# EasyEDA schematic sch-knx-valve-control_v1.0.json
TITLE: KNX 8 Heating Actuators Control; REV: 1.0; Date: 2025-11-12; Sheet: 1/1; Company: LL Production
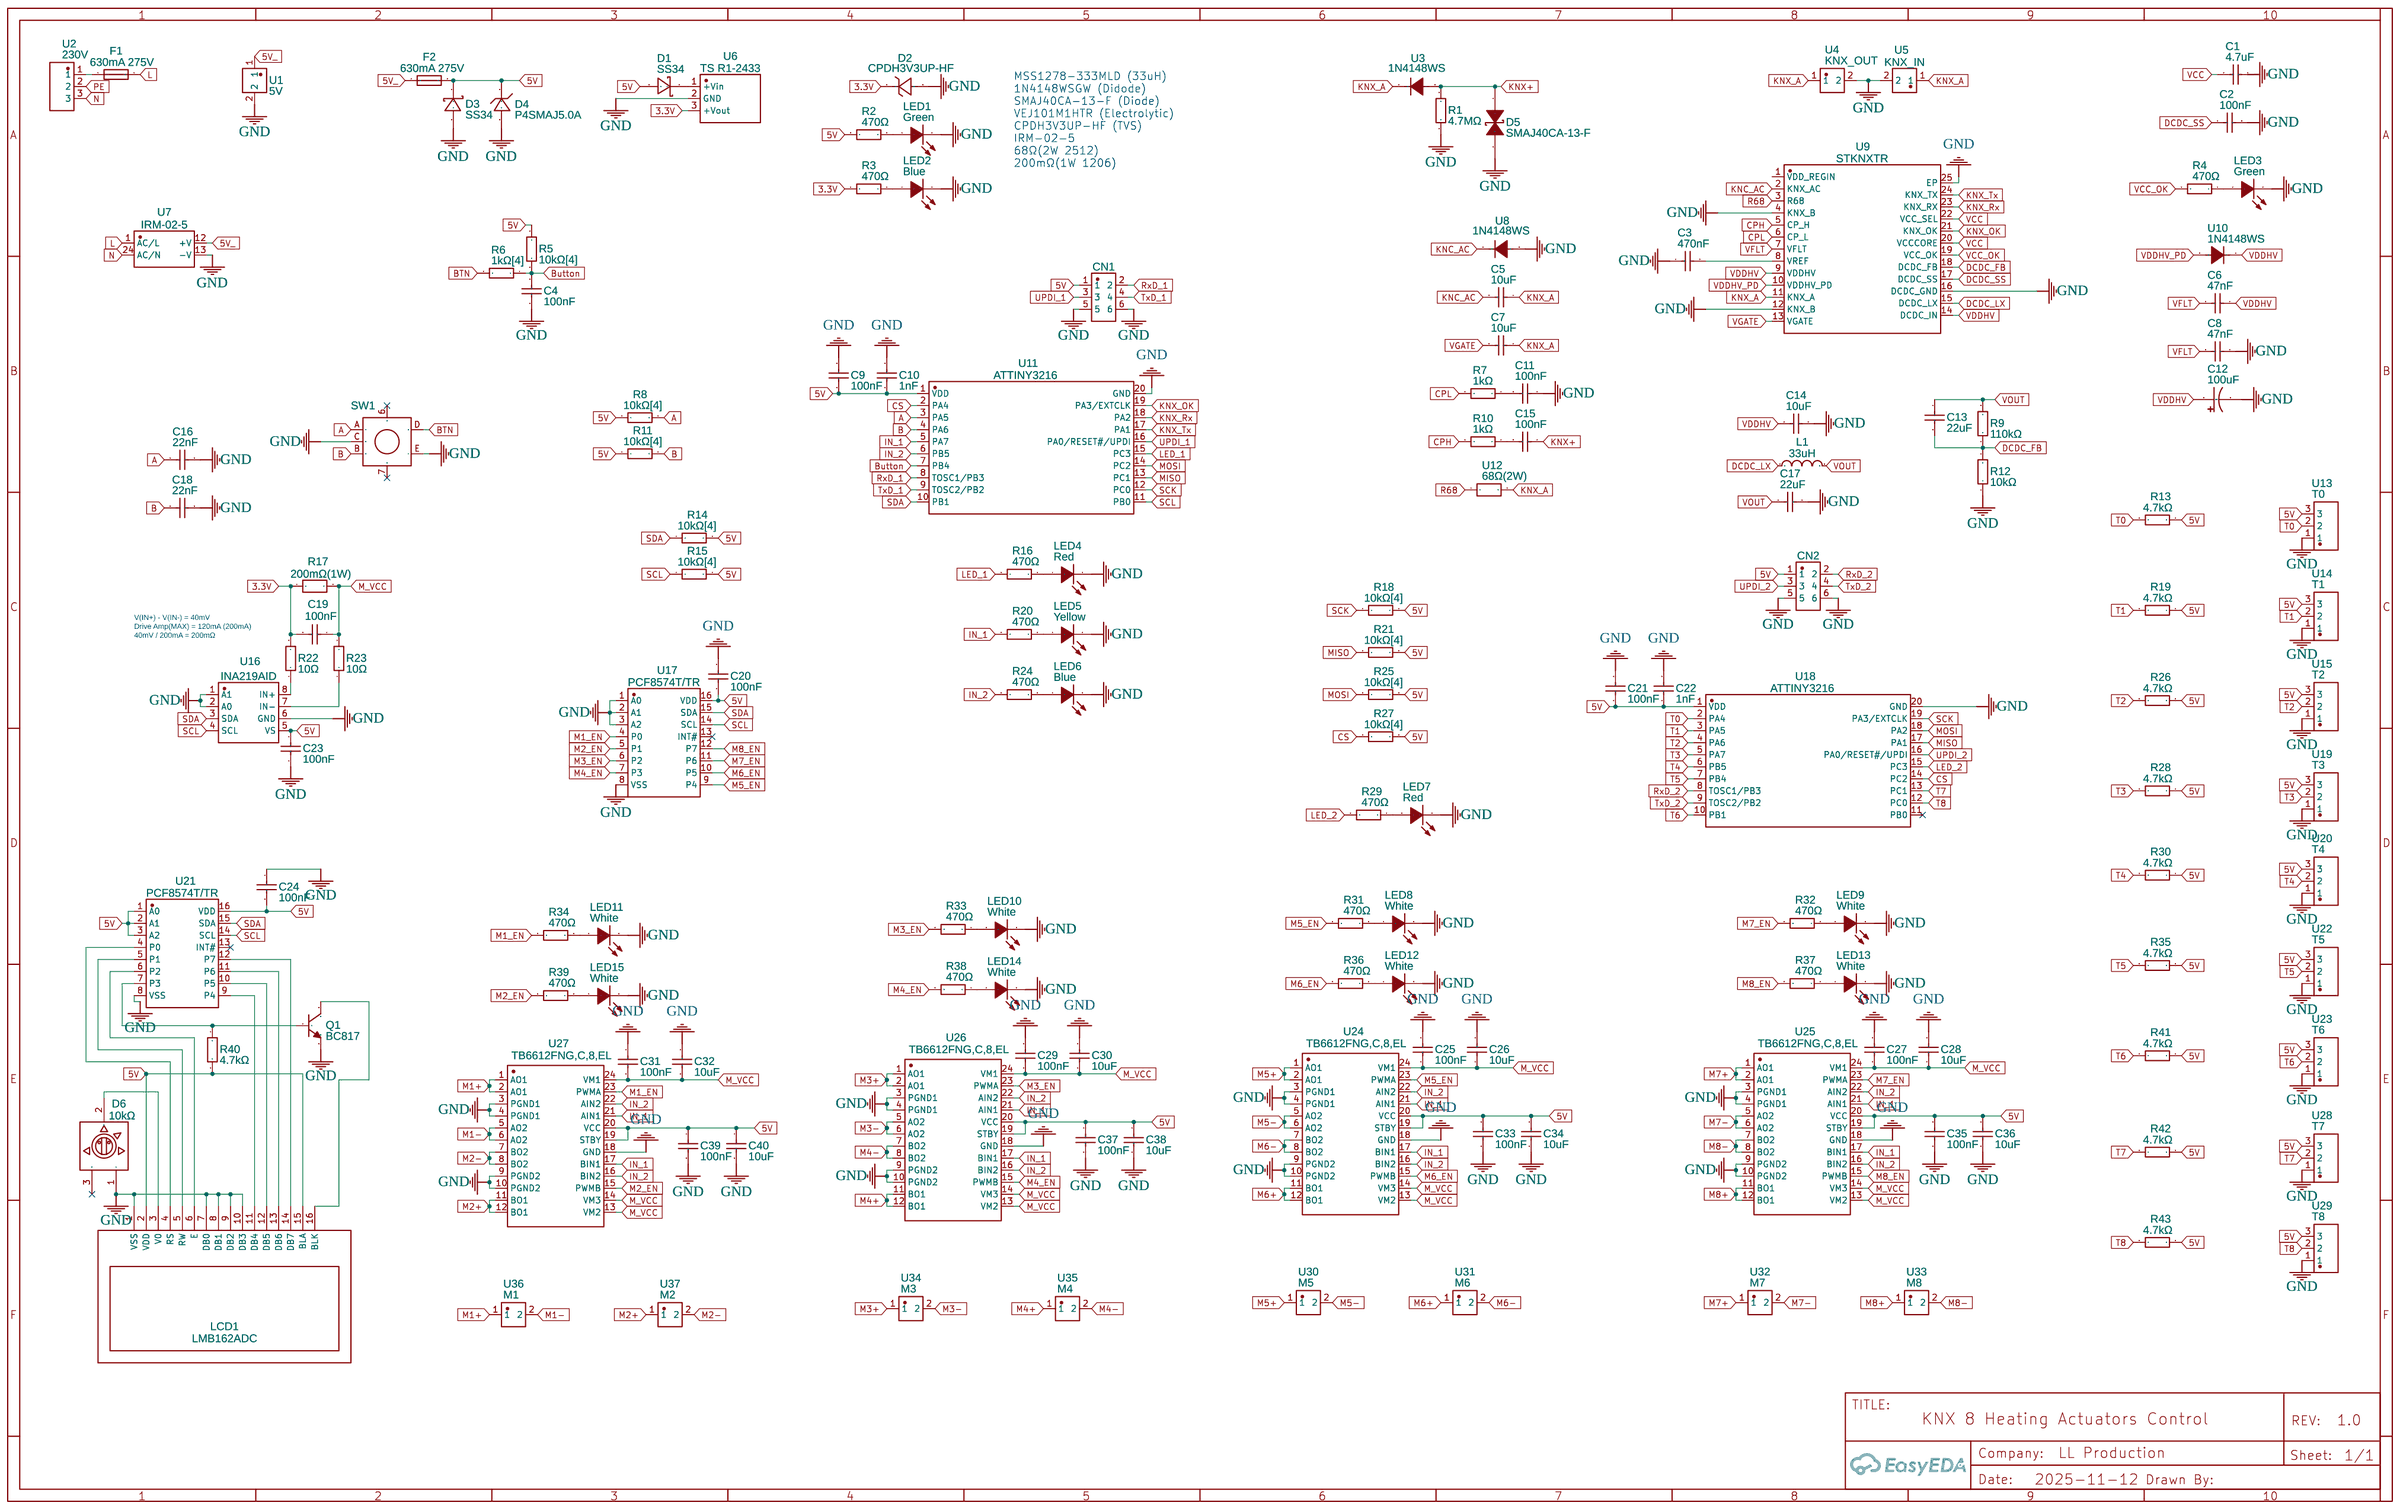
[diagram p0: schematic sheet]

## Parts
C1  4.7uF  [C0603]
C2  100nF  [C0603]
C3  470nF  [C0603]
C4  100nF  [C0603]
C5  10uF  [C0603]
C6  47nF  [C0603]
C7  10uF  [C0603]
C8  47nF  [C0603]
C9  100nF  [C0603]
C10  1nF  [C0603]
C11  100nF  [C0603]
C12  100uF  [CAP-SMD_BD8.0-L8.3-W8.3-RD]
C13  22uF  [C0603]
C14  10uF  [C0603]
C15  100nF  [C0603]
C16  22nF  [C0603]
C17  22uF  [C0603]
C18  22nF  [C0603]
C19  100nF  [C0603]
C20  100nF  [C0603]
C21  100nF  [C0603]
C22  1nF  [C0603]
C23  100nF  [C0603]
C24  100nF  [C0603]
C25  100nF  [C0603]
C26  10uF  [C0603]
C27  100nF  [C0603]
C28  10uF  [C0603]
C29  100nF  [C0603]
C30  10uF  [C0603]
C31  100nF  [C0603]
C32  10uF  [C0603]
C33  100nF  [C0603]
C34  10uF  [C0603]
C35  100nF  [C0603]
C36  10uF  [C0603]
C37  100nF  [C0603]
C38  10uF  [C0603]
C39  100nF  [C0603]
C40  10uF  [C0603]
CN1  321006SG0ABK00A01  [IDC-TH_321006SG0ABK00A01]
CN2  321006SG0ABK00A01  [IDC-TH_321006SG0ABK00A01]
D1  SS34  [SMA_L4.3-W2.6-LS5.2-RD]
D2  CPDH3V3UP-HF  [SOD-523_L1.2-W0.8-LS1.6-RD-1]
D3  SS34  [SMA_L4.3-W2.6-LS5.2-RD]
D4  P4SMAJ5.0A  [SMA_L4.3-W2.6-LS5.2-RD]
D5  SMAJ40CA-13-F  [SMA_L4.4-W2.6-LS5.0-BI]
D6  10kΩ  [RES-ADJ-SMD_3314G-1-103E]
F1  630mA 275V  [FUSE-SMD_L10.1-W3.1]
F2  630mA 275V  [FUSE-SMD_L10.1-W3.1]
L1  33uH  [IND-SMD_L12.0-W12.0_CHILISIN_MSS1278]
LCD1  LMB162ADC  [LCD1602]
LED1  Green  [LED0603-R-RD]
LED2  Blue  [LED0603-R-RD]
LED3  Green  [LED0603-R-RD]
LED4  Red  [LED0603-R-RD]
LED5  Yellow  [LED0603-R-RD]
LED6  Blue  [LED0603-R-RD]
LED7  Red  [LED0603-R-RD]
LED8  White  [LED0603-R-RD]
LED9  White  [LED0603-R-RD]
LED10  White  [LED0603-R-RD]
LED11  White  [LED0603-R-RD]
LED12  White  [LED0603-R-RD]
LED13  White  [LED0603-R-RD]
LED14  White  [LED0603-R-RD]
LED15  White  [LED0603-R-RD]
Q1  BC817  [SOT-23-3_L2.9-W1.6-P1.90-LS2.8-BR]
R1  4.7MΩ  [R0603]
R2  470Ω  [R0603]
R3  470Ω  [R0603]
R4  470Ω  [R0603]
R5  10kΩ[4]  [R0402]
R6  1kΩ[4]  [R0402]
R7  1kΩ  [R0603]
R8  10kΩ[4]  [R0402]
R9  110kΩ  [R0603]
R10  1kΩ  [R0603]
R11  10kΩ[4]  [R0402]
R12  10kΩ  [R0603]
R13  4.7kΩ  [R0603]
R14  10kΩ[4]  [R0402]
R15  10kΩ[4]  [R0402]
R16  470Ω  [R0603]
R17  200mΩ(1W)  [R1206]
R18  10kΩ[4]  [R0402]
R19  4.7kΩ  [R0603]
R20  470Ω  [R0603]
R21  10kΩ[4]  [R0402]
R22  10Ω  [R0603]
R23  10Ω  [R0603]
R24  470Ω  [R0603]
R25  10kΩ[4]  [R0402]
R26  4.7kΩ  [R0603]
R27  10kΩ[4]  [R0402]
R28  4.7kΩ  [R0603]
R29  470Ω  [R0603]
R30  4.7kΩ  [R0603]
R31  470Ω  [R0603]
R32  470Ω  [R0603]
R33  470Ω  [R0603]
R34  470Ω  [R0603]
R35  4.7kΩ  [R0603]
R36  470Ω  [R0603]
R37  470Ω  [R0603]
R38  470Ω  [R0603]
R39  470Ω  [R0603]
R40  4.7kΩ  [R0603]
R41  4.7kΩ  [R0603]
R42  4.7kΩ  [R0603]
R43  4.7kΩ  [R0603]
SW1  EC11L1525G01  [SW-TH_ALPS_EC11L1525G01]
U1  5V  [CONN-TH_2P-P5.08_C9900012979]
U2  230V  [CONN-TH_3P-P5.08_DB127V-5.08-3P-GN-S]
U3  1N4148WS  [SOD-323_L1.7-W1.3-LS2.7-RD]
U4  KNX_OUT  [CONN-TH_2P-P5.08_C9900012979]
U5  KNX_IN  [CONN-TH_2P-P5.08_C9900012979]
U6  TS R1-2433  [PWRM-TH_3P-L11.7-W7.6-P2.54_R1-2433]
U7  IRM-02-5  [PWRM-TH_L33.7-W22.2_IRM-02-24]
U8  1N4148WS  [SOD-323_L1.7-W1.3-LS2.7-RD]
U9  STKNXTR  [VFQFPN-24_L4.0-W4.0-P0.50-BL-EP2.8]
U10  1N4148WS  [SOD-323_L1.7-W1.3-LS2.7-RD]
U11  ATTINY3216  [SOIC-20_L13.0-W7.6-P1.27-LS10.3-BL]
U12  68Ω(2W)  [R2512]
U13  T0  [CONN-TH_3P-P5.08_DB127V-5.08-3P-GN-S]
U14  T1  [CONN-TH_3P-P5.08_DB127V-5.08-3P-GN-S]
U15  T2  [CONN-TH_3P-P5.08_DB127V-5.08-3P-GN-S]
U16  INA219AID  [SOIC-8_L4.9-W3.9-P1.27-LS6.0-BL]
U17  PCF8574T/TR  [SO-16_L10.3-W7.5-P1.27-LS10.3-BL]
U18  ATTINY3216  [SOIC-20_L13.0-W7.6-P1.27-LS10.3-BL]
U19  T3  [CONN-TH_3P-P5.08_DB127V-5.08-3P-GN-S]
U20  T4  [CONN-TH_3P-P5.08_DB127V-5.08-3P-GN-S]
U21  PCF8574T/TR  [SO-16_L10.3-W7.5-P1.27-LS10.3-BL]
U22  T5  [CONN-TH_3P-P5.08_DB127V-5.08-3P-GN-S]
U23  T6  [CONN-TH_3P-P5.08_DB127V-5.08-3P-GN-S]
U24  TB6612FNG,C,8,EL  [SSOP-24_L8.3-W5.6-P0.65-LS7.6-BL]
U25  TB6612FNG,C,8,EL  [SSOP-24_L8.3-W5.6-P0.65-LS7.6-BL]
U26  TB6612FNG,C,8,EL  [SSOP-24_L8.3-W5.6-P0.65-LS7.6-BL]
U27  TB6612FNG,C,8,EL  [SSOP-24_L8.3-W5.6-P0.65-LS7.6-BL]
U28  T7  [CONN-TH_3P-P5.08_DB127V-5.08-3P-GN-S]
U29  T8  [CONN-TH_3P-P5.08_DB127V-5.08-3P-GN-S]
U30  M5  [CONN-TH_2P-P5.08_C9900012979]
U31  M6  [CONN-TH_2P-P5.08_C9900012979]
U32  M7  [CONN-TH_2P-P5.08_C9900012979]
U33  M8  [CONN-TH_2P-P5.08_C9900012979]
U34  M3  [CONN-TH_2P-P5.08_C9900012979]
U35  M4  [CONN-TH_2P-P5.08_C9900012979]
U36  M1  [CONN-TH_2P-P5.08_C9900012979]
U37  M2  [CONN-TH_2P-P5.08_C9900012979]

## Library data of the parts
C1-C11 C13-C40 = CC0603KRX7R9BB103: Supplier: LCSC; Manufacturer: YAGEO; Supplier Part: C100042; JLCPCB Part Class: Extended Part
C12 = VEJ101M1HTR-0810: Contributor: LCSC; Supplier: LCSC; Supplier Part: C176665; Manufacturer: Lelon(立隆); JLCPCB Part Class: Extended Part
CN1 CN2 = 321006SG0ABK00A01: Contributor: LCSC; Supplier: LCSC; Supplier Part: C601936; Manufacturer: JILN(锦凌); JLCPCB Part Class: Extended Part; link: https://lcsc.com/eda_search?q=C601936&%26type=1&ref=editor
D1 D3 = SS34_C8678: Supplier: LCSC; Manufacturer: MDD; Supplier Part: C8678; JLCPCB Part Class: Basic Part; link: https://lcsc.com/eda_search?q=C8678&%26type=1&ref=editor
D2 = SOD-523: Contributor: LCSC; Supplier: LCSC; Supplier Part: C9900005315; Manufacturer: null; JLCPCB Part Class: Extended Part
D4 = P4SMAJ12A-PEC: Contributor: LCSC; Supplier: LCSC; Supplier Part: C263332; Manufacturer: PANJIT(强茂); Manufacturer Part: P4SMAJ12A_R1_00001; JLCPCB Part Class: Extended Part
D5 = SMAJ40CA-13-F: Contributor: LCSC; Supplier: LCSC; Manufacturer: DIODES(美台); Supplier Part: C134986; JLCPCB Part Class: Extended Part
D6 = 3314G-1-103E: Contributor: LCSC; Supplier: LCSC; Supplier Part: C780220; Manufacturer: BOURNS; JLCPCB Part Class: Extended Part; link: https://lcsc.com/eda_search?q=C780220&%26type=1&ref=editor
F1 F2 = S1032-F-60.0A: Contributor: LCSC; Supplier: LCSC; Supplier Part: C553920; Manufacturer: SART(萨特); JLCPCB Part Class: Extended Part
L1 = MSS1278-333MLD: Contributor: lcsc; Supplier: LCSC; Supplier Part: C9900015074; Manufacturer: null; JLCPCB Part Class: Extended Part
LCD1 = LMB162ADC: Supplier: LCSC; Manufacturer: TOPWAY; Supplier Part: C9741
LED1-LED15 = SZYY0603R: Supplier: LCSC; Supplier Part: C434419; Manufacturer: yongyu(永裕光电); Contributor: LCSC; JLCPCB Part Class: Extended Part
Q1 = BC817-40,215: Supplier: LCSC; Manufacturer: Nexperia(安世); Supplier Part: C52801; JLCPCB Part Class: Extended Part
R1-R4 R7 R9 R10 R12 R13 R16 R19 R20 R22-R24 R26 R28-R43 = CR0603FA1001G_C126900: Supplier: LCSC; Manufacturer: LIZ(丽智电子); Manufacturer Part: CR0603FA1001G; Supplier Part: C126900; Resistance (Ohms): 1K; JLCPCB Part Class: Extended Part
R5 R6 R8 R11 R14 R15 R18 R21 R25 R27 = 0402WGF1002TCE: Supplier: LCSC; Manufacturer: UNI-ROYAL(厚声); Supplier Part: C25744; JLCPCB Part Class: Basic Part
R17 = SCR1206F1M1: Supplier: LCSC; Supplier Part: C3017245; Manufacturer: VO(翔胜); JLCPCB Part Class: Extended Part; Contributor: lcsc
SW1 = EC11L1525G01: Contributor: lcsc; Supplier: LCSC; Supplier Part: C2991196; Manufacturer: ALPSALPINE(阿尔卑斯阿尔派); JLCPCB Part Class: Extended Part; link: https://lcsc.com/eda_search?q=C2991196&%26type=1&ref=editor
U1 U4 U5 U30-U37 = 2P,间距5.08MM,弹片压线升降式: Supplier: LCSC; Supplier Part: C9900012979; Manufacturer: null; Manufacturer Part: 2P,间距5.08mm,弹片压线升降式; Contributor: LCSC; JLCPCB Part Class: Extended Part
U2 U13-U15 U19 U20 U22 U23 U28 U29 = DB127V-5.08-3P-GN-S: Supplier: LCSC; Supplier Part: C3018699; Manufacturer: DIBO(地博电气); link: https://atta.szlcsc.com/upload/public/pdf/source/20230106/9E8F75CF958F44CA83513B3CECA15E79.pdf; Contributor: lcsc; JLCPCB Part Class: Extended Part
U3 U8 U10 = 1N4148WS: Supplier: LCSC; Supplier Part: C19272188; Manufacturer: Zhengxin(正芯); Contributor: lcsc
U6 = TS R1-2433: Supplier: LCSC; Supplier Part: C5455553; Manufacturer: TRACO POWER; JLCPCB Part Class: Extended Part; Contributor: lcsc
U7 = IRM-02-5: Supplier: LCSC; Supplier Part: C22394236; Manufacturer: MW(明纬); Contributor: lcsc; JLCPCB Part Class: Extended Part
U9 = STKNXTR: Contributor: LCSC; Supplier: LCSC; Supplier Part: C2671486; Manufacturer: ST(意法半导体); JLCPCB Part Class: Extended Part
U11 U18 = ATTINY1616-SN_C614136: Contributor: lcsc; Supplier: LCSC; Supplier Part: C614136; Manufacturer: MICROCHIP(美国微芯); Manufacturer Part: ATTINY1616-SN; link: https://lcsc.com/eda_search?q=C614136&%26type=1&ref=editor
U12 = HOJLR2512-3W-3.5MR-1%: Contributor: lcsc; Supplier: LCSC; Supplier Part: C2904235; Manufacturer: Milliohm(毫欧); Manufacturer Part: HoJLR2512-3W-3.5mR-1%; JLCPCB Part Class: Extended Part
U16 = INA219AID: Contributor: lcsc; Supplier: LCSC; Supplier Part: C1574856; Manufacturer: TI(德州仪器); JLCPCB Part Class: Extended Part
U17 U21 = PCF8574T/TR: Supplier: LCSC; Supplier Part: C2987288; Manufacturer: HGSEMI(华冠); link: https://atta.szlcsc.com/upload/public/pdf/source/20190611/C398075_1925312D8618E19C6137781D5B71A3CA.pdf; Contributor: lcsc; JLCPCB Part Class: Extended Part
U24-U27 = TB6612FNG,C,8,EL: Contributor: LCSC; Supplier: LCSC; Manufacturer: TOSHIBA(东芝); Supplier Part: C141517; JLCPCB Part Class: Extended Part

## Nets
3.3V: C19.2 D2.1(K) R3.2 R17.1 R22.2 U6.3(+Vout)
5V: C9.1 C10.1 C20.2 C21.1 C22.1 C23.1 C24.2 C33.1 C34.1 C35.1 C36.1 C37.1 C38.1 C39.1 C40.1 CN1.1 CN2.1 D1.2(A) D3.1(K) D4.1(C) F2.2 LCD1.2(VDD) LCD1.15(BLA) R2.2 R5.1 R8.1 R11.1 R13.1 R14.2 R15.2 R18.2 R19.1 R21.2 R25.2 R26.1 R27.2 R28.1 R30.1 R35.1 R40.2 R41.1 R42.1 R43.1 U11.1(VDD) U13.3 U14.3 U15.3 U16.5(VS) U17.16(VDD) U18.1(VDD) U19.3 U20.3 U21.1(A0) U21.2(A1) U21.3(A2) U21.16(VDD) U22.3 U23.3 U24.19(STBY) U24.20(VCC) U25.19(STBY) U25.20(VCC) U26.19(STBY) U26.20(VCC) U27.19(STBY) U27.20(VCC) U28.3 U29.3
5V_: F2.1 U1.1 U7.12(+V)
GND: C1.1 C2.2 C3.1 C4.2 C8.1 C9.2 C10.2 C11.1 C12.2 C14.2 C16.1 C17.2 C18.1 C20.1 C21.2 C22.2 C23.2 C24.1 C25.1 C26.1 C27.1 C28.1 C29.1 C30.1 C31.1 C32.1 C33.2 C34.2 C35.2 C36.2 C37.2 C38.2 C39.2 C40.2 CN1.5 CN1.6 CN2.5 CN2.6 D2.2(A) D3.2(A) D4.2(A) D5.2 D6.1 LCD1.1(VSS) LCD1.7(DB0) LCD1.8(DB1) LCD1.9(DB2) LCD1.10(DB3) LED1.2(-) LED2.2(-) LED3.2(-) LED4.2(-) LED5.2(-) LED6.2(-) LED7.2(-) LED8.2(-) LED9.2(-) LED10.2(-) LED11.2(-) LED12.2(-) LED13.2(-) LED14.2(-) LED15.2(-) Q1.2 R1.1 R12.1 SW1.C SW1.E U1.2 U4.2 U5.2 U6.2(GND) U7.13(-V) U8.2(A) U9.4(KNX_B) U9.12(KNX_B) U9.16(DCDC_GND) U9.25(EP) U11.20(GND) U13.1 U14.1 U15.1 U16.1(A1) U16.2(A0) U16.6(GND) U17.1(A0) U17.2(A1) U17.3(A2) U17.8(VSS) U18.20(GND) U19.1 U20.1 U21.8(VSS) U22.1 U23.1 U24.3(PGND1) U24.4(PGND1) U24.9(PGND2) U24.10(PGND2) U24.18(GND) U25.3(PGND1) U25.4(PGND1) U25.9(PGND2) U25.10(PGND2) U25.18(GND) U26.3(PGND1) U26.4(PGND1) U26.9(PGND2) U26.10(PGND2) U26.18(GND) U27.3(PGND1) U27.4(PGND1) U27.9(PGND2) U27.10(PGND2) U27.18(GND) U28.1 U29.1
VCC: C1.2 U9.20(VCCCORE) U9.22(VCC_SEL)
VCC_OK: R4.2 U9.19(VCC_OK)
VDDHV: C6.1 C12.1 C14.1 U9.9(VDDHV) U9.14(DCDC_IN) U10.1(K)
VDDHV_PD: U9.10(VDDHV_PD) U10.2(A)
A: C16.2 R8.2 SW1.A U11.3(PA5)
B: C18.2 R11.2 SW1.B U11.4(PA6)
BTN: R6.2 SW1.D
Button: C4.1 R5.2 R6.1 U11.7(PB4)
CPH: R10.2 U9.5(CP_H)
CPL: R7.2 U9.6(CP_L)
CS: R27.1 U11.2(PA4) U18.14(PC2)
DCDC_FB: C13.2 R9.1 R12.2 U9.18(DCDC_FB)
DCDC_LX: L1.1 U9.15(DCDC_LX)
DCDC_SS: C2.1 U9.17(DCDC_SS)
IN_1: R20.2 U11.5(PA7) U24.17(BIN1) U24.21(AIN1) U25.17(BIN1) U25.21(AIN1) U26.17(BIN1) U26.21(AIN1) U27.17(BIN1) U27.21(AIN1)
IN_2: R24.2 U11.6(PB5) U24.16(BIN2) U24.22(AIN2) U25.16(BIN2) U25.22(AIN2) U26.16(BIN2) U26.22(AIN2) U27.16(BIN2) U27.22(AIN2)
KNC_AC: C5.2 U8.1(K) U9.2(KNX_AC)
KNX+: C15.1 D5.1 R1.2 U3.2(A)
KNX_A: C5.1 C7.1 U3.1(K) U4.1 U5.1 U9.11(KNX_A) U12.2
KNX_OK: U9.21(KNX_OK) U11.19(PA3/EXTCLK)
KNX_Rx: U9.23(KNX_RX) U11.18(PA2)
KNX_Tx: U9.24(KNX_TX) U11.17(PA1)
L: F1.2 U7.1(AC/L)
LED_1: R16.2 U11.15(PC3)
LED_2: R29.2 U18.15(PC3)
M1+: U27.1(AO1) U27.2(AO1) U36.1
M1-: U27.5(AO2) U27.6(AO2) U36.2
M1_EN: R34.2 U17.4(P0) U27.23(PWMA)
M2+: U27.11(BO1) U27.12(BO1) U37.1
M2-: U27.7(BO2) U27.8(BO2) U37.2
M2_EN: R39.2 U17.5(P1) U27.15(PWMB)
M3+: U26.1(AO1) U26.2(AO1) U34.1
M3-: U26.5(AO2) U26.6(AO2) U34.2
M3_EN: R33.2 U17.6(P2) U26.23(PWMA)
M4+: U26.11(BO1) U26.12(BO1) U35.1
M4-: U26.7(BO2) U26.8(BO2) U35.2
M4_EN: R38.2 U17.7(P3) U26.15(PWMB)
M5+: U24.1(AO1) U24.2(AO1) U30.1
M5-: U24.5(AO2) U24.6(AO2) U30.2
M5_EN: R31.2 U17.9(P4) U24.23(PWMA)
M6+: U24.11(BO1) U24.12(BO1) U31.1
M6-: U24.7(BO2) U24.8(BO2) U31.2
M6_EN: R36.2 U17.10(P5) U24.15(PWMB)
M7+: U25.1(AO1) U25.2(AO1) U32.1
M7-: U25.5(AO2) U25.6(AO2) U32.2
M7_EN: R32.2 U17.11(P6) U25.23(PWMA)
M8+: U25.11(BO1) U25.12(BO1) U33.1
M8-: U25.7(BO2) U25.8(BO2) U33.2
M8_EN: R37.2 U17.12(P7) U25.15(PWMB)
M_VCC: C19.1 C25.2 C26.2 C27.2 C28.2 C29.2 C30.2 C31.2 C32.2 R17.2 R23.2 U24.13(VM2) U24.14(VM3) U24.24(VM1) U25.13(VM2) U25.14(VM3) U25.24(VM1) U26.13(VM2) U26.14(VM3) U26.24(VM1) U27.13(VM2) U27.14(VM3) U27.24(VM1)
MISO: R21.1 U11.13(PC1) U18.17(PA1)
MOSI: R25.1 U11.14(PC2) U18.18(PA2)
N: U2.3 U7.24(AC/N)
PE: U2.2
R68: U9.3(R68) U12.1
RxD_1: CN1.2 U11.8(TOSC1/PB3)
RxD_2: CN2.2 U18.8(TOSC1/PB3)
SCK: R18.1 U11.12(PC0) U18.19(PA3/EXTCLK)
SCL: R15.1 U11.11(PB0) U16.4(SCL) U17.14(SCL) U21.14(SCL)
SDA: R14.1 U11.10(PB1) U16.3(SDA) U17.15(SDA) U21.15(SDA)
T0: R13.2 U13.2 U18.2(PA4)
T1: R19.2 U14.2 U18.3(PA5)
T2: R26.2 U15.2 U18.4(PA6)
T3: R28.2 U18.5(PA7) U19.2
T4: R30.2 U18.6(PB5) U20.2
T5: R35.2 U18.7(PB4) U22.2
T6: R41.2 U18.10(PB1) U23.2
T7: R42.2 U18.13(PC1) U28.2
T8: R43.2 U18.12(PC0) U29.2
TxD_1: CN1.4 U11.9(TOSC2/PB2)
TxD_2: CN2.4 U18.9(TOSC2/PB2)
UPDI_1: CN1.3 U11.16(PA0/RESET#/UPDI)
UPDI_2: CN2.3 U18.16(PA0/RESET#/UPDI)
VFLT: C6.2 C8.2 U9.7(VFLT)
VGATE: C7.2 U9.13(VGATE)
VOUT: C13.1 C17.1 L1.2 R9.2
Net-(C3-2): C3.2 U9.8(VREF)
Net-(C11-2): C11.2 R7.1
Net-(C15-2): C15.2 R10.1
Net-(D1-1): D1.1(K) U6.1(+Vin)
Net-(D6-2): D6.2 LCD1.3(V0)
Net-(F1-1): F1.1 U2.1
Net-(LCD1-4): LCD1.4(RS) U21.4(P0)
Net-(LCD1-5): LCD1.5(RW) U21.5(P1)
Net-(LCD1-6): LCD1.6(E) U21.6(P2)
Net-(LCD1-11): LCD1.11(DB4) U21.9(P4)
Net-(LCD1-12): LCD1.12(DB5) U21.10(P5)
Net-(LCD1-13): LCD1.13(DB6) U21.11(P6)
Net-(LCD1-14): LCD1.14(DB7) U21.12(P7)
Net-(LCD1-16): LCD1.16(BLK) Q1.3
Net-(LED1-1): LED1.1(+) R2.1
Net-(LED2-1): LED2.1(+) R3.1
Net-(LED3-1): LED3.1(+) R4.1
Net-(LED4-1): LED4.1(+) R16.1
Net-(LED5-1): LED5.1(+) R20.1
Net-(LED6-1): LED6.1(+) R24.1
Net-(LED7-1): LED7.1(+) R29.1
Net-(LED8-1): LED8.1(+) R31.1
Net-(LED9-1): LED9.1(+) R32.1
Net-(LED10-1): LED10.1(+) R33.1
Net-(LED11-1): LED11.1(+) R34.1
Net-(LED12-1): LED12.1(+) R36.1
Net-(LED13-1): LED13.1(+) R37.1
Net-(LED14-1): LED14.1(+) R38.1
Net-(LED15-1): LED15.1(+) R39.1
Net-(Q1-1): Q1.1 R40.1 U21.7(P3)
Net-(R22-1): R22.1 U16.8(IN+)
Net-(R23-1): R23.1 U16.7(IN-)

Not connected (* = marked no-connect by the designer): D6 3*; SW1 6(EH)* 7(EH)*; U9 1(VDD_REGIN); U17 13(INT#)*; U18 11(PB0)*; U21 13(INT#)*

## Notes on the sheet
- MSS1278-333MLD (33uH)
  1N4148WSGW (Didode)
  SMAJ40CA-13-F (Diode)
  VEJ101M1HTR (Electrolytic)
  CPDH3V3UP-HF (TVS)
  IRM-02-5
  68Ω(2W 2512)
  200mΩ(1W 1206)
- V(IN+) - V(IN-) = 40mV
  Drive Amp(MAX) = 120mA (200mA)
  40mV / 200mA = 200mΩ
